# Altium schematic sheet Eurocard VME 6U P2.SchDoc: FPGA Motherboard for Digital Multiplexed Readout, McGill U.
size Tabloid; DocumentNumber: DfMUX25; Revision: Rev0, Prototype; SheetNumber: 25; SheetTotal: 27; PageSetup: Record=PageOptions|CenterHorizontal=True|CenterVertical=True|PrintScale=0.95|XCorrection=1.00|YCorrection=1.00|PrintKind=0|BorderSize=5000000|LeftOffset=0|BottomOffset=0|Orientation=2|PaperLength=1000|PaperWidth=1000|Scale=100|PaperSource=7|PrintQuality=-4|MediaType=1|DitherType=10|PaperKind=Tabloid|PrintScaleMode=1
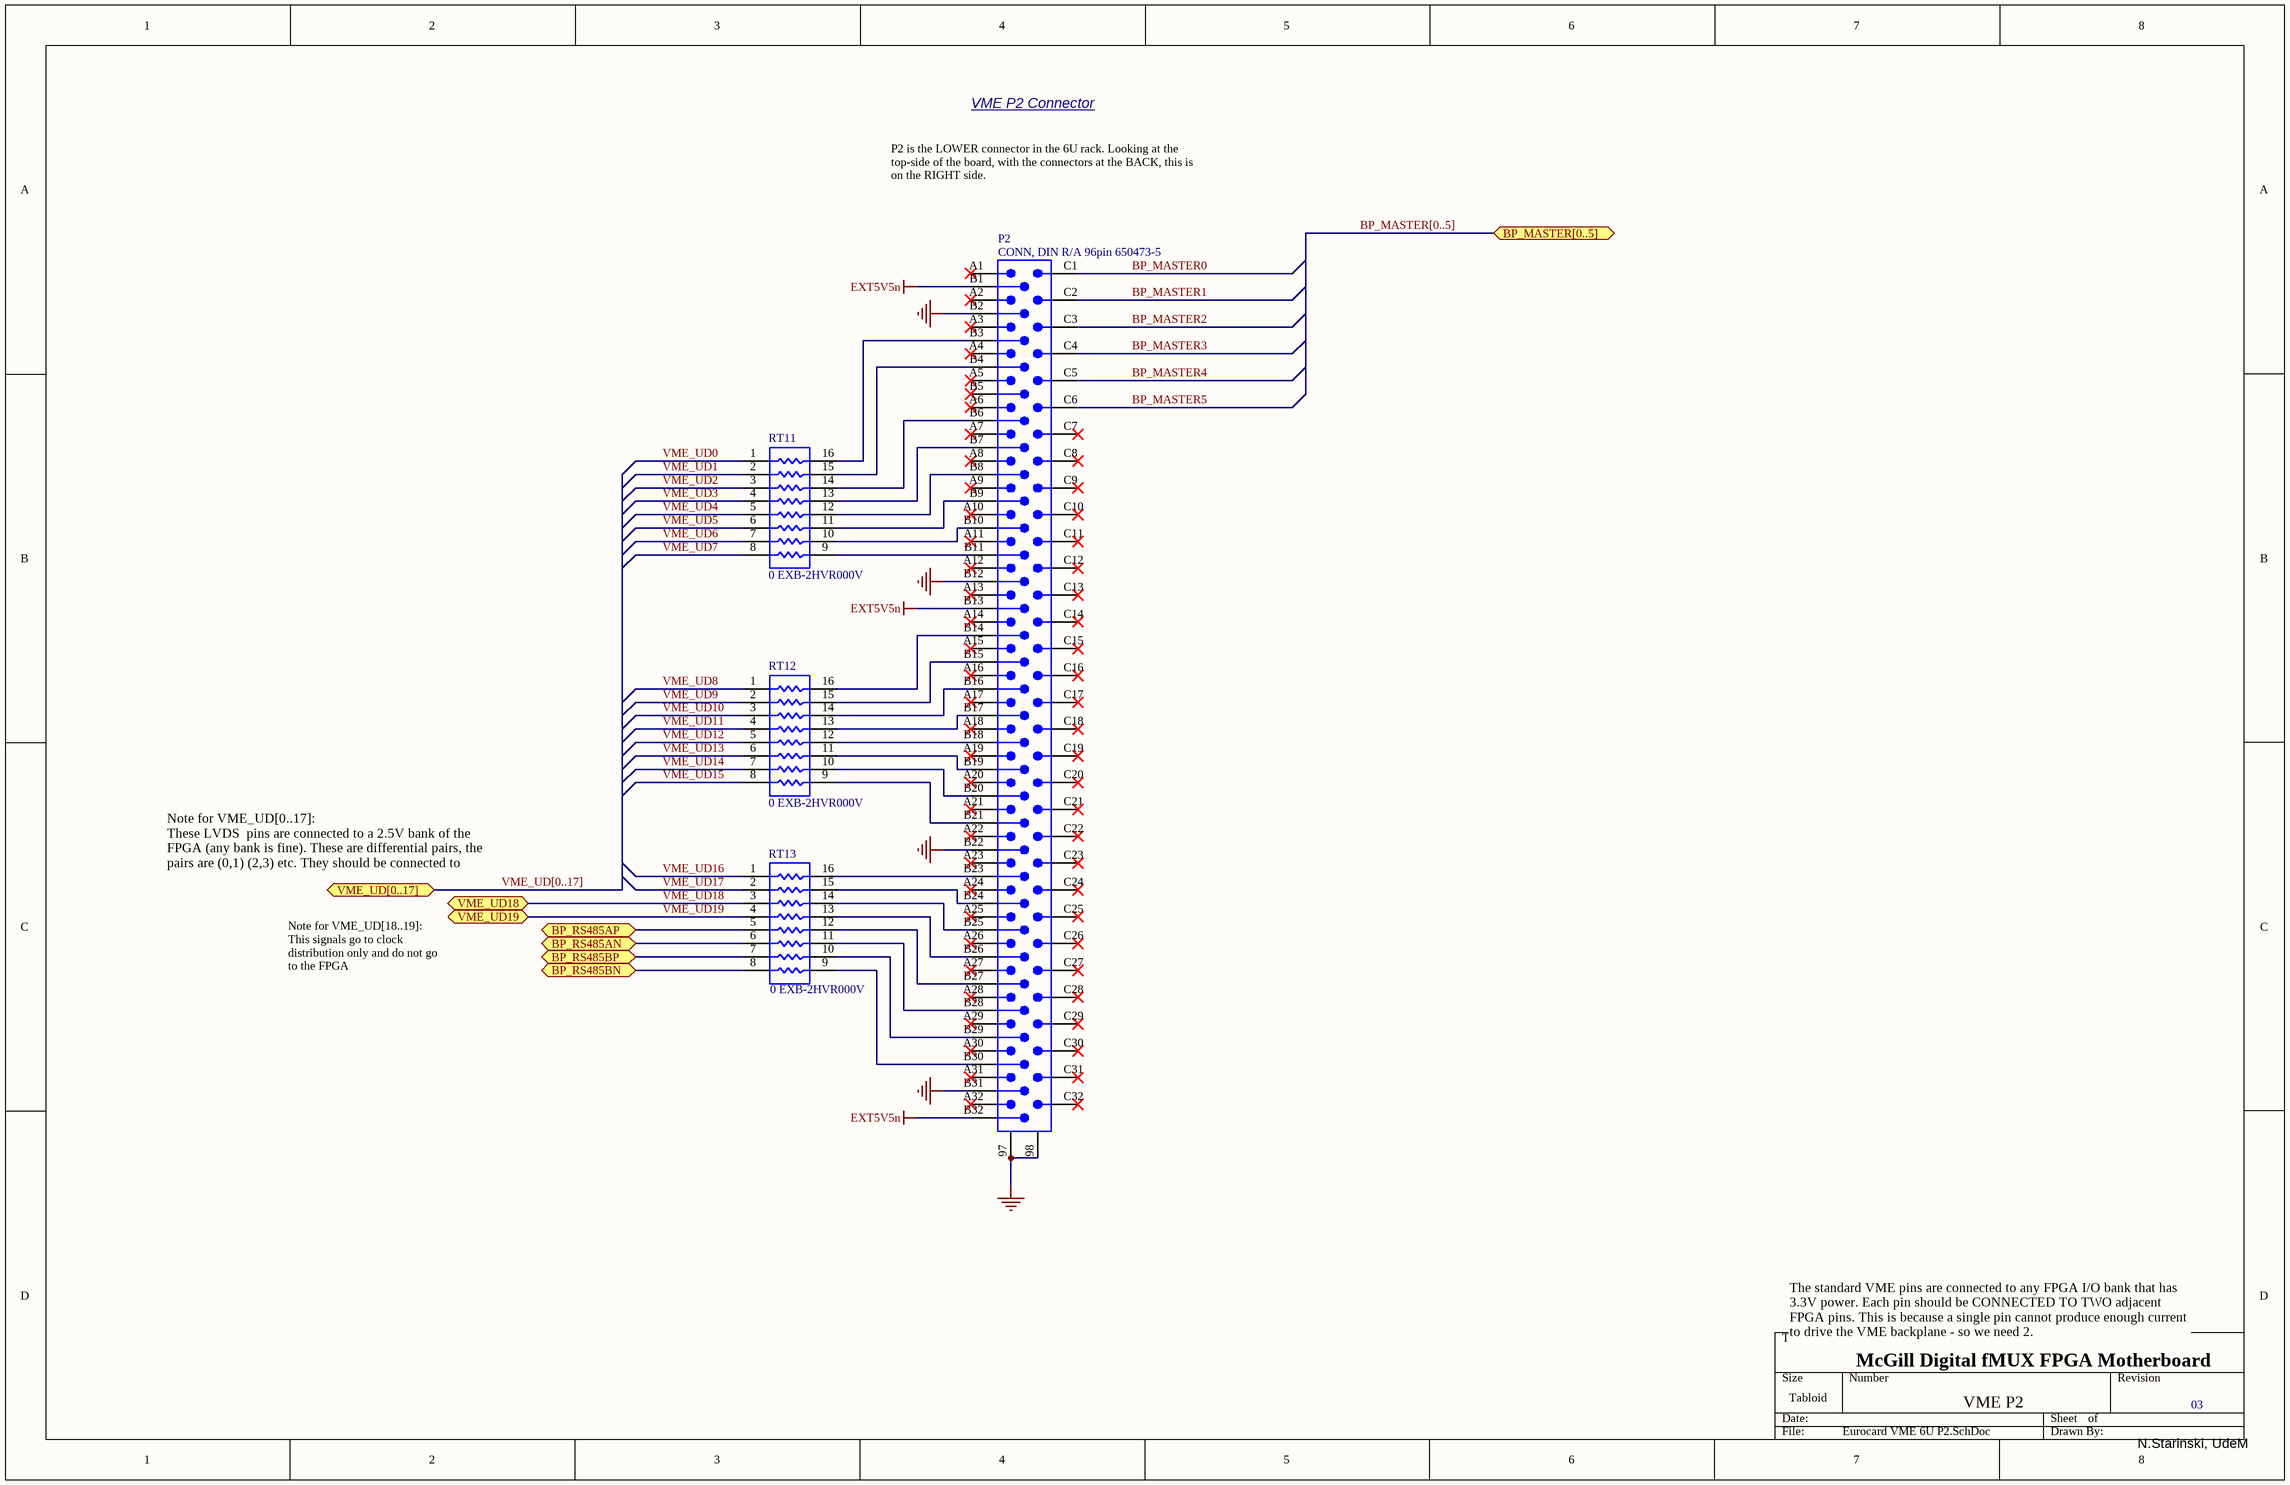
[diagram p0: Eurocard VME 6U P2.SchDoc]

## Parts
P2  CONN, DIN R/A 96pin 650473-5  [CNVME96]
RT11  0 EXB-2HVR000V  [0402_Array_2HV]
RT12  0 EXB-2HVR000V  [0402_Array_2HV]
RT13  0 EXB-2HVR000V  [0402_Array_2HV]

## Ports
BP_MASTER[0..5], BP_RS485AN (bidir), BP_RS485AP (bidir), BP_RS485BN (bidir), BP_RS485BP (bidir), VME_UD18 (bidir), VME_UD19 (bidir), VME_UD[0..17] (bidir)

## Nets
EXT5V5n: P2.B1 P2.B13 P2.B32
GND: P2.97 P2.98 P2.B2 P2.B12 P2.B22 P2.B31
BP_MASTER0: P2.C1
BP_MASTER1: P2.C2
BP_MASTER2: P2.C3
BP_MASTER3: P2.C4
BP_MASTER4: P2.C5
BP_MASTER5: P2.C6
BP_RS485AN: RT13.6 ; port BP_RS485AN
BP_RS485AP: RT13.5 ; port BP_RS485AP
BP_RS485BN: RT13.8 ; port BP_RS485BN
BP_RS485BP: RT13.7 ; port BP_RS485BP
VME_UD0: RT11.1
VME_UD1: RT11.2
VME_UD2: RT11.3
VME_UD3: RT11.4
VME_UD4: RT11.5
VME_UD5: RT11.6
VME_UD6: RT11.7
VME_UD7: RT11.8
VME_UD8: RT12.1
VME_UD9: RT12.2
VME_UD10: RT12.3
VME_UD11: RT12.4
VME_UD12: RT12.5
VME_UD13: RT12.6
VME_UD14: RT12.7
VME_UD15: RT12.8
VME_UD16: RT13.1
VME_UD17: RT13.2
VME_UD18: RT13.3 ; port VME_UD18
VME_UD19: RT13.4 ; port VME_UD19
NetP2_B3: P2.B3 RT11.16
NetP2_B4: P2.B4 RT11.15
NetP2_B6: P2.B6 RT11.14
NetP2_B7: P2.B7 RT11.13
NetP2_B8: P2.B8 RT11.12
NetP2_B9: P2.B9 RT11.11
NetP2_B10: P2.B10 RT11.10
NetP2_B11: P2.B11 RT11.9
NetP2_B14: P2.B14 RT12.16
NetP2_B15: P2.B15 RT12.15
NetP2_B16: P2.B16 RT12.14
NetP2_B17: P2.B17 RT12.13
NetP2_B18: P2.B18 RT12.12
NetP2_B19: P2.B19 RT12.11
NetP2_B20: P2.B20 RT12.10
NetP2_B21: P2.B21 RT12.9
NetP2_B23: P2.B23 RT13.16
NetP2_B24: P2.B24 RT13.15
NetP2_B25: P2.B25 RT13.14
NetP2_B26: P2.B26 RT13.13
NetP2_B27: P2.B27 RT13.12
NetP2_B28: P2.B28 RT13.11
NetP2_B29: P2.B29 RT13.10
NetP2_B30: P2.B30 RT13.9

Not connected (* = marked no-connect by the designer): P2 A1* A2* A3* A4* A5* A6* A7* A8* A9* A10* A11* A12* A13* A14* A15* A16* A17* A18* A19* A20* A21* A22* A23* A24* A25* A26* A27* A28* A29* A30* A31* A32* B5* C7* C8* C9* C10* C11* C12* C13* C14* C15* C16* C17* C18* C19* C20* C21* C22* C23* C24* C25* C26* C27* C28* C29* C30* C31* C32*

## Buses and harness runs
bus BP_MASTER[0..5] = port BP_MASTER[0..5]
bus VME_UD[0..17] = port VME_UD[0..17]

## Notes on the sheet
- VME P2 Connector
- P2 is the LOWER connector in the 6U rack. Looking at the top-side of the board, with the connectors at the BACK, this is on the RIGHT side.
- Note for VME_UD[0..17]:
  These LVDS  pins are connected to a 2.5V bank of the FPGA (any bank is fine). These are differential pairs, the pairs are (0,1) (2,3) etc. They should be connected to pins with P,N.
- Note for VME_UD[18..19]:
  This signals go to clock distribution only and do not go to the FPGA
- The standard VME pins are connected to any FPGA I/O bank that has 3.3V power. Each pin should be CONNECTED TO TWO adjacent FPGA pins. This is because a single pin cannot produce enough current to drive the VME backplane - so we need 2.
- McGill Digital fMUX FPGA Motherboard
- VME P2
- 03
- N.Starinski, UdeM

## Library data of the parts
P2 = CNVME96: 96-Pin Connector (3x32 2.54mm grid); Text Field6: Alternate Layout Available; Text Field7: Published 14-Feb-2002
RT11-RT13 = Res Pack3: Isolated Resistor Network; Published: 24-Mar-1999; LatestRevisionDate: 17-Jul-2002; LatestRevisionNote: Re-released for DXP Platform.; Publisher: Altium Limited